# Altium schematic sheet RF_Bypass.SchDoc
size 279 x 215 mm; SheetNumber: 5; SheetTotal: 6
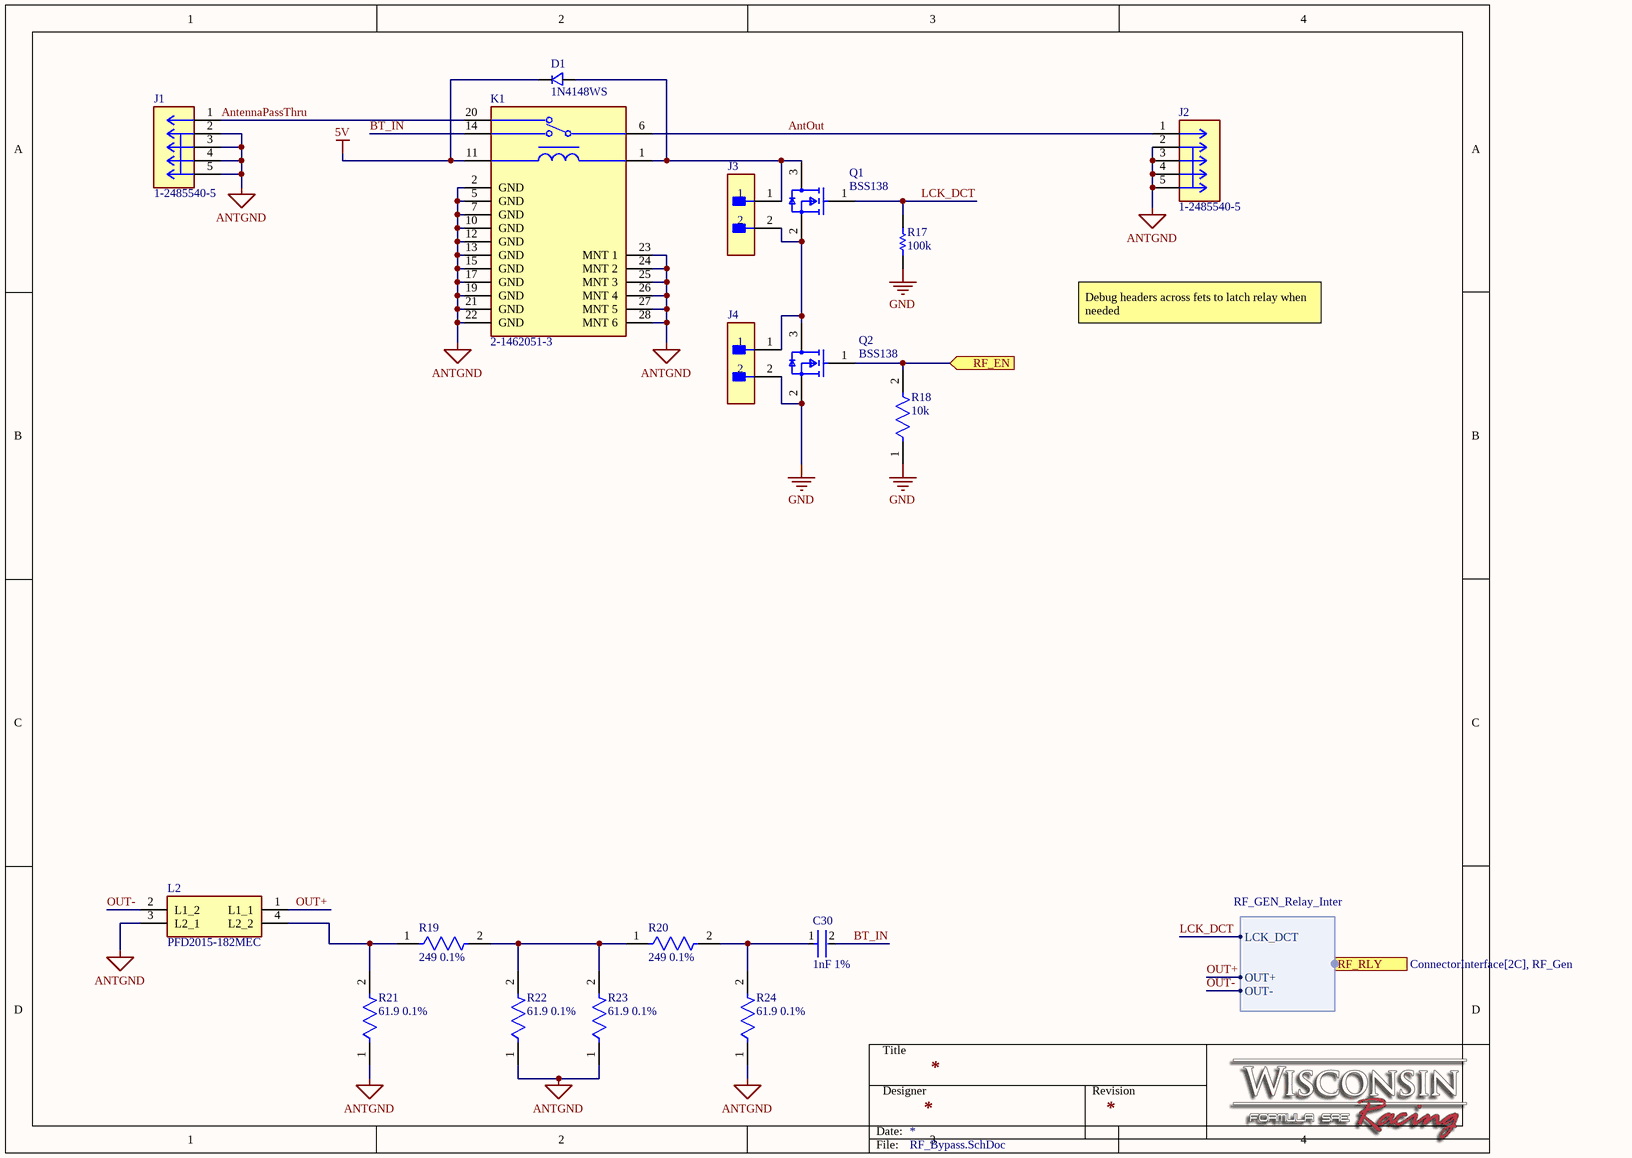
[diagram p0: RF_Bypass.SchDoc]

## Parts
C30  1nF 1%  [FP-GRT155-0_05-IPC_A]
D1  1N4148WS  [SODFL250X90-2N]
J1  1-2485540-5  [1-2485540-5-Footprint-1]
J2  1-2485540-5  [1-2485540-5-Footprint-1]
J3  TSM-102-01-T-SV-TR  [FP-TSM-102-01-T-SV-TR-MFG]  (value not drawn)
J4  TSM-102-01-T-SV-TR  [FP-TSM-102-01-T-SV-TR-MFG]  (value not drawn)
K1  2-1462051-3  [FP-2-1462051-3-MFG]
L2  PFD2015-182MEC  [PFD2015102MEB]
Q1  BSS138  [FP-318-08-IPC_B]
Q2  BSS138  [FP-318-08-IPC_B]
R17  100k  [RESC1005X40X25NL05T10]
R18  10k  [FP-RC0402-0_4-IPC_C]
R19  249 0.1%  [FP-RT0402-MFG]
R20  249 0.1%  [FP-RT0402-MFG]
R21  61.9 0.1%  [FP-RP73P-1E-MFG]
R22  61.9 0.1%  [FP-RP73P-1E-MFG]
R23  61.9 0.1%  [FP-RP73P-1E-MFG]
R24  61.9 0.1%  [FP-RP73P-1E-MFG]

## Ports
RF_EN (in), RF_RLY (harness RF_GEN_Relay_Inter, see ConnectorInterface[2C], RF_Gen)

## Harnesses
RF_GEN_Relay_Inter: LCK_DCT, OUT+, OUT-

## Nets
5V: D1.1 K1.11(-)
ANTGND: J1.2 J1.3 J1.4 J1.5 J2.2 J2.3 J2.4 J2.5 K1.2(GND) K1.5(GND) K1.7(GND) K1.10(GND) K1.12(GND) K1.13(GND) K1.15(GND) K1.17(GND) K1.19(GND) K1.21(GND) K1.22(GND) K1.23(MNT_1) K1.24(MNT_2) K1.25(MNT_3) K1.26(MNT_4) K1.27(MNT_5) K1.28(MNT_6) L2.3(L2_1) R21.1 R22.1 R23.1 R24.1
GND: J4.2 Q2.2(S) R17.1 R18.1
AntennaPassThru: J1.1 K1.20
AntOut: J2.1 K1.6
BT_IN: C30.2 K1.14
LCK_DCT: Q1.1(G) R17.2 ; port RF_RLY.LCK_DCT
OUT+: L2.1(L1_1) ; port RF_RLY.OUT+
OUT-: L2.2(L1_2) ; port RF_RLY.OUT-
RF_EN: Q2.1(G) R18.2 ; port RF_EN
NetC30_1: C30.1 R20.2 R24.2
NetD1_2: D1.2 J3.1 K1.1(+) Q1.3(D)
NetJ3_2: J3.2 J4.1 Q1.2(S) Q2.3(D)
NetL2_4: L2.4(L2_2) R19.1 R21.2
NetR19_2: R19.2 R20.1 R22.2 R23.2

## Notes on the sheet
- Debug headers across fets to latch relay when needed
- Title
- Designer
- Revision
- Date:
- File:

## Library data of the parts
C30 = CMP-06035-012909-1: Multi-Layer Ceramic Capacitor 1nF 50V C0G ±1% 0402 Paper T/R / GRT1555C1H102FA02D
D1 = CMP-REC-0001-6: Diode
J1 J2 = CMP-00172-1: FAKRA Connector, Plug, 50 ohm, Locking, 6 GHz, Cable-to-Board, 1 Position, Printed Circuit Board, -40 – 105 °C [-40 – 221 °F], Solder, FAKRA
J3 J4 = CMP-02766-000113-1: CONN HEADER SMD 2POS 2.54MM; Gender: Male; Max Voltage Rating (AC): 475V; Number of Contacts: 2; Max Current Rating: 7A; Contact Material: Bronze; Min Operating Temperature: -55°C; REACH SVHC: No SVHC; Housing Material: Polymer; Lead Free: Lead Free; Orientation: Straight; Radiation Hardening: No; Number of Rows: 1; Length: 5.08mm; Housing Color: Black; Max Operating Temperature: 105°C; Contact Plating: Tin; Depth: 2.54mm; Packaging: Tape and Reel; Pitch: 2.54mm; Termination: Solder
K1 = CMP-03396-000136-1: RELAY RF SPDT 2A 5V; Max Voltage Rating (AC): 250V; Contact Voltage Rating (DC): 220V; Operate Time: 3ms; Actuating System: DC; Release Time: 5ms; Coil Resistance: 178R; Coil Current: 28.1mA; Insertion Loss: -0.3dB; Coil Power: 140mW; Coil Type: Non-Latching; Contact Current Rating: 2A; Radiation Hardening: No; Voltage Rating (AC): 250V; ELV: Compliant; Max Voltage Rating (DC): 220V; Min Operating Temperature: -55°C; Coil Voltage (DC): 5V; Number of Pins: 22; Max Current Rating: 2A; Height: 10.5mm; Package Quantity: 250; Termination: PCB; Length: 14.9inch; RoHS Compliant: No; Packaging: Box; Width: 0.295inch; Depth: 9.4mm; Relay Type: Relay; Mount: Surface Mount; Throw Configuration: SPDT; Contact Plating: Gold; Contact Material: Nickel; Weight: 3oz; Series: HF3S, AXICOM; Max Operating Temperature: 85°C
L2 = PFD2015-102MEB: Inductor; Manufacturer_Name: COILCRAFT; Datasheet Link: https://www.coilcraft.com/pdfs/pfd2015_flyback.pdf; Height: 1.5mm; Manufacturer_Part_Number: PFD2015-102MEB; Mouser Part Number: 994-PFD2015-102MEB; Mouser Price/Stock: https://www.mouser.com/Search/Refine.aspx?Keyword=994-PFD2015-102MEB
Q1 Q2 = CMP-07173-000101-1: MOSFET N-CH 50V 220MA SOT-23; Turn-Off Delay Time: 20ns; Element Configuration: Single; Rds On Max: 3.5R; Gate to Source Voltage (Vgs): 20V; Threshold Voltage: 1.3V; Number of Elements: 1; Power Dissipation: 360mW; Rise Time: 9ns; Turn-On Delay Time: 2.5ns; Input Capacitance: 27pF; On-State Resistance: 6R; Lead Free: Lead Free; Length: 2.92mm; Width: 1.3mm; Drain to Source Breakdown Voltage: 50V; Min Operating Temperature: -55°C; REACH SVHC: No SVHC; Packaging: Tape and Reel; Radiation Hardening: No; Height: 0.93mm; Drain to Source Voltage (Vdss): 50V; Current Rating: 220mA; Voltage Rating (DC): 50V; Weight: 0.03g; Continuous Drain Current (ID): 220mA; Number of Pins: 3; Nominal Vgs: 1.3V; Max Power Dissipation: 360mW; Fall Time: 9ns; Drain to Source Resistance: 3.5R; Contact Plating: Tin; Case/Package: SOT-23; Package Quantity: 1; Dual Supply Voltage: 50V; Mount: Surface Mount; Termination: SMD/SMT; Max Operating Temperature: 150°C
R17 = CMP-2002-07343-1: Part Number: RC0402FR-07100KL; Manufacturer: Yageo / Phycomp
R18 = CMP-2002-07915-3: RES 10K OHM 5% 1/16W 0402; Max Power Dissipation: 63mW; Temperature Coefficient: 100ppm/°C; Power Rating: 62.5mW; Resistance: 10kR; Voltage Rating: 50V; Size Code: 0402; Resistance Tolerance: 5%; Packaging: Tape and Reel; Case Code (Metric): 1005; Lead Free: Lead Free; Resistor Type: Thick Film; Min Operating Temperature: -55°C; Military Standard: Not; Depth: 0.5mm; Series: RC; Case/Package: 0402; Construction: Rectangular; Number of Terminations: 2; Package Quantity: 1; Termination: SMD/SMT; Length: 0.039inch; Case Code (Imperial): 0402; Height: 0.016inch; Features: Moisture Resistant; RoHS Compliant: Yes; Max Operating Temperature: 155°C; Tolerance: 5%; Width: 0.02inch
R19 R20 = CMP-2002-02712-2: RES SMD 249 OHM 0.1% 1/16W 0402; Manufacturer: Yageo; Manufacturer Part Number: RT0402BRD07249RL; Temperature Coefficient: 25 ppm/°C; Power Rating: 0.063W; Value: 249Ω; Voltage Rating: 50V; Tolerance: 0.001; Footprint Url: http://www.yageo.com/exep/pages/download/literatures/PYu-R_Mount_10.pdf; Device Class L3: Chip SMD Resistors; Category: Res; Resistance: 249Ω; Device Class L2: Resistors; Height: 0.35mm; Device Class L1: Passive Components; Package: RT0402; Ipc Land Pattern Name: RESC10050X30; Temperature Range Low: -55°C; Lead Free: Yes; ComponentLink2Description: Datasheet; Octopart: https://octopart.com/rt0402brd07249rl-yageo-1467928; Digikey Description: RES SMD 249 OHM 0.1% 1/16W 0402; Automotive: No; Composition: Thin Film; Temperature: -55°C to +155°C; RoHS: TRUE; Temperature Range High: +155°C; Series: RT; Mouser Description: Thin Film Resistors - SMD 1/16W 249 ohm .1% 25ppm; ComponentLink2URL: http://www.yageo.com/documents/recent/PYu-RT_1-to-0.01_RoHS_L_9.pdf
R21-R24 = CMP-03211-009150-1: RP73P 0402 61.9Ω 0.1W 25ppm/°C 0.10% 50V; Manufacturer: TE Connectivity; Manufacturer Part Number: RP73PF1E61R9BTD; Temperature Coefficient: 25ppm/°C; Temperature: -55°C to +155°C; Voltage Rating: 50V; Composition: Thin Film; Value: 61.9Ω; Ipc Land Pattern Name: RESC10050X30; Device Class L3: Chip SMD Resistors; Resistance: 61.9Ω; Octopart: https://octopart.com/rp73pf1e61r9btd-te+connectivity-89230235; ComponentLink2URL: https://www.te.com/commerce/DocumentDelivery/DDEController?Action=srchrtrv&DocNm=1773272&DocType=DS&DocLang=English; RoHS: TRUE; Device Class L2: Resistors; Series: RP73P; Temperature Range Low: -55°C; Category: Res; ComponentLink2Description: Datasheet; Temperature Range High: +155°C; Height: 0.35mm; Lead Free: Yes; Automotive: No; Power Rating: 0.1W; Package: RP73P-1E; Device Class L1: Passive Components; Tolerance: 0.10%